# Altium schematic sheet SAM4N_Xplained_Pro_Oscillators.SchDoc: Crystal Oscillators
size A3; Organization: ATMEL Norway; Address1: Vestre Rosten 79; Address2: N-7075 TILLER; Address3: NORWAY; DocumentNumber: 5; Revision: 5; SheetNumber: 5; SheetTotal: 8; PageSetup: Record=PageOptions|CenterHorizontal=True|CenterVertical=True|PrintScale=1.01|XCorrection=1.00|YCorrection=1.00|PrintKind=1|BorderSize=5000000|LeftOffset=0|BottomOffset=0|Orientation=2|PaperLength=1000|PaperWidth=1000|Scale=100|PaperSource=7|PrintQuality=-4|MediaType=1|DitherType=10|PaperKind=A3 (297 x 420 mm)|PrintScaleMode=1
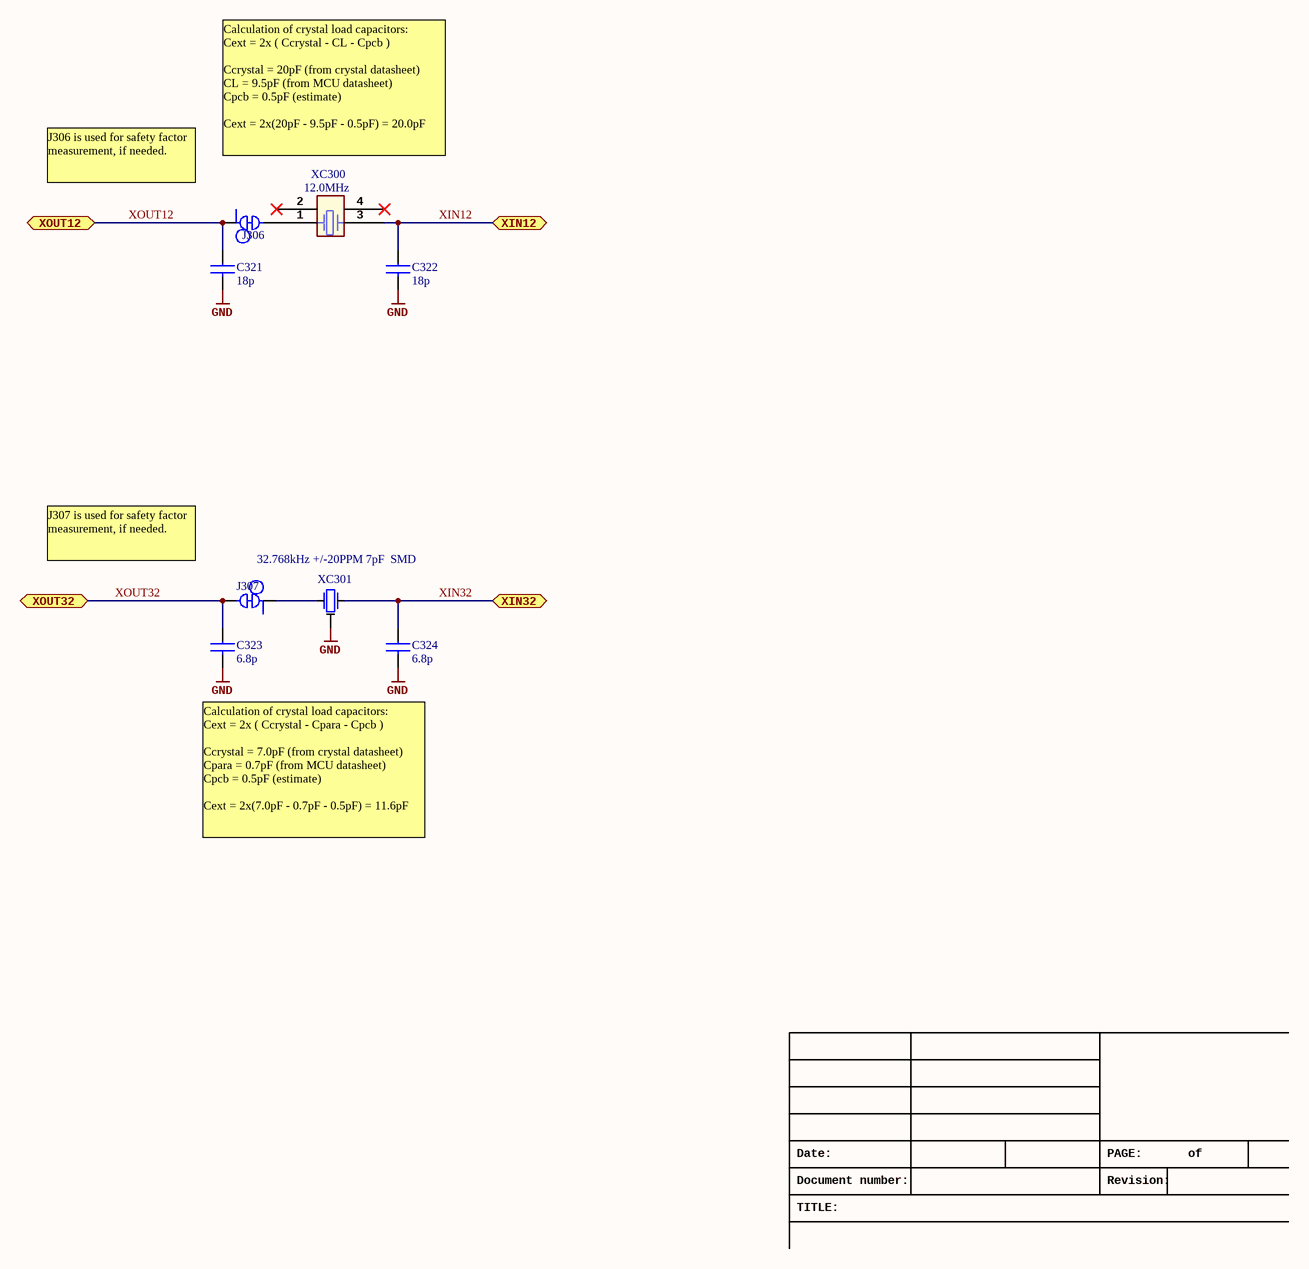
[diagram p0: SAM4N_Xplained_Pro_Oscillators.SchDoc]

## Parts
C321  18p  [AP1-00001]
C322  18p  [AP1-00001]
C323  value 6.8p  [AP1-00001]  (hidden comment: CAP-NONPOL)
C324  value 6.8p  [AP1-00001]  (hidden comment: CAP-NONPOL)
J306  SMD-STRAP_CLOSED  [AP9-00044]  (value not drawn)  (net tie, no BOM)
J307  SMD-STRAP_CLOSED  [AP9-00044]  (value not drawn)  (net tie, no BOM)
XC300  12.0MHz  [AP7-00039]
XC301  value 32.768kHz +/-20PPM 7pF  SMD  [AP7-00044]  (hidden comment: Farnell order no:1539364)

## Ports
XIN12, XIN32, XOUT12, XOUT32

## Nets
GND: C321.2 C322.2 C323.2 C324.2 XC301.3
XIN12: C322.1 XC300.3 ; port XIN12
XIN32: C324.1 XC301.2 ; port XIN32
XOUT12: C321.1 J306.1 ; port XOUT12
XOUT32: C323.1 J307.2 ; port XOUT32
NetJ306_2: J306.2 XC300.1
NetJ307_1: J307.1 XC301.1

Not connected (* = marked no-connect by the designer): XC300 2* 4*

## Notes on the sheet
- Calculation of crystal load capacitors:
  Cext = 2x ( Ccrystal - CL - Cpcb )
  Ccrystal = 20pF (from crystal datasheet)
  CL = 9.5pF (from MCU datasheet)
  Cpcb = 0.5pF (estimate)
  Cext = 2x(20pF - 9.5pF - 0.5pF) = 20.0pF
- J306 is used for safety factor measurement, if needed.
- J307 is used for safety factor measurement, if needed.
- Calculation of crystal load capacitors:
  Cext = 2x ( Ccrystal - Cpara - Cpcb )
  Ccrystal = 7.0pF (from crystal datasheet)
  Cpara = 0.7pF (from MCU datasheet)
  Cpcb = 0.5pF (estimate)
  Cext = 2x(7.0pF - 0.7pF - 0.5pF) = 11.6pF
- Date:
- PAGE:
- of
- TITLE:
- Document number:
- Revision:

## Library data of the parts
C321 C322 = A01-0018: Ceramic capacitor, SMD 0402, NP0, 50V, +/-5%; PartGroup: Capacitors,Ceramic,SMD 0402; TemperatureRange: -55 - +125 deg C; ComponentStatus: 'Active (verified)'; Status: Active; Verified by: Lars Helge Mo; Verified date: 2005-12-15; AN: A01-0018; Value: 18p; Tolerance: 50V, +/-5%; Height: 0.550000011920929; FootprintStatus: 'Active (Verified)'
C323 C324 = A01-0013: Ceramic capacitor, SMD 0402, NP0, 50V, +/-5%; PartGroup: Capacitors,Ceramic,SMD 0402; TemperatureRange: -55 - +125 deg C; ComponentStatus: 'Active (verified)'; Status: Active; Verified by: Lars Helge Mo; Verified date: 2005-12-15; AN: A01-0013; Tolerance: 50V, +/-5%; Height: 0.550000011920929; FootprintStatus: 'Active (Verified)'
J306 J307 = A09-0783: Default closed SMD strap, 0603 size; PartGroup: Mechanical devices,PCB implemented components; Value: SMD-STRAP_0603_CLOSED; ComponentStatus: 'Active (verified)'; AN: A09-0783; Height: 0; FootprintStatus: 'Active (Verified)'
XC300 = A07-0042: Fox FQ5032B 12.0MHz SMD crystal 738B-12; PartGroup: Frequency devices,Crystals,SMD; Manufacturer: Fox  Electronics; MPN: FQ5032B-12-C-C-C-200-1; Tolerance: 30PPM; ComponentStatus: 'Active (verified)'; Status: Active; Verified by: Ketil Skjerve; Verified date: 2007-06-15; AN: A07-0042; Value: 12.0MHz; Height: 1,20000004768372; FootprintStatus: 'Active (Verified)'
XC301 = A07-0052: 32k768 crystal, +-20ppm, CL=7pF, max ESR 60kOhm, SMD; PartGroup: Frequency devices,Crystals,SMD; Manufacturer: Micro Crystal; MPN: MS1V-T1K 32.768kHz 7pF +/-20PPM TA; Tolerance: +/- 20 PPM; TemperatureRange: -40 /+85; ComponentStatus: 'Active (verified)'; AN: A07-0052; Height: 2,07999992370605; FootprintStatus: 'Active (Verified)'